# Altium project Sensors_CW.PrjPcb
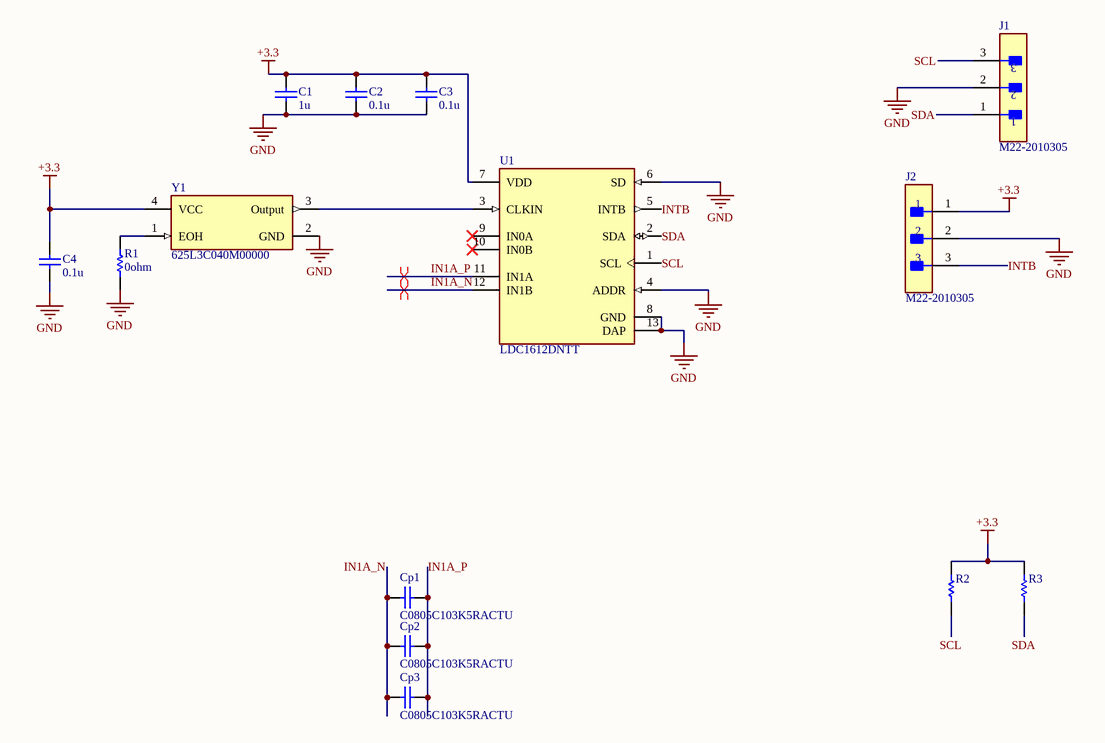
[diagram p0: Schematic_Sensors.SchDoc]
1 sheet, 14 parts. Net scope: global (net labels, ports and power ports of the same name join across sheets).
Board files: PCB_Sensors.PcbDoc, PCB1.PcbDoc

## Sheet Schematic_Sensors.SchDoc
size A3; SheetNumber: 1; SheetTotal: 1

### Parts
C1  1u  [CAPC1608X90X35ML10T15]
C2  0.1u  [CAPC1608X90X35ML10T15]
C3  0.1u  [CAPC1608X90X35ML10T15]
C4  0.1u  [CAPC1608X90X35ML10T15]
Cp1  C0805C103K5RACTU  [CAPC2013X88X50LL20T25]
Cp2  C0805C103K5RACTU  [CAPC2013X88X50LL20T25]
Cp3  C0805C103K5RACTU  [CAPC2013X88X50LL20T25]
J1  M22-2010305  [FP-M22-2010305-MFG]
J2  M22-2010305  [FP-M22-2010305-MFG]
R1  0ohm  [RESC1608X55X25ML10T15]
R2  CRCW060310K0FKEA  [RESC1609X50X30NL8T20]  (value not drawn)
R3  CRCW060310K0FKEA  [RESC1609X50X30NL8T20]  (value not drawn)
U1  LDC1612DNTT  [FP-DNT0012B-MFG]
Y1  625L3C040M00000  [FP-625-MFG]

### Nets
+3.3: C1.2 C2.2 C3.2 C4.2 J2.1 R2.2 R3.2 U1.7(VDD) Y1.4(VCC)
GND: C1.1 C2.1 C3.1 C4.1 J1.2 J2.2 R1.1 U1.4(ADDR) U1.6(SD) U1.8(GND) U1.13(DAP) Y1.2(GND)
IN1A_N: Cp1.1 Cp2.1 Cp3.1 U1.12(IN1B)
IN1A_P: Cp1.2 Cp2.2 Cp3.2 U1.11(IN1A)
INTB: J2.3 U1.5(INTB)
SCL: J1.3 R2.1 U1.1(SCL)
SDA: J1.1 R3.1 U1.2(SDA)
NetR1_2: R1.2 Y1.1(EOH)
NetU1_3: U1.3(CLKIN) Y1.3(Output)

Not connected (* = marked no-connect by the designer): U1 9(IN0A)* 10(IN0B)*

### Layout directives
differential pair: IN1A_N, IN1A_P

### Library data of the parts
C1-C4 = CMP-2000-04945-1: Chip Capacitor, 22 pF, +/- 5%, 50 V, -55 to 125 degC, 0603 (1608 Metric), RoHS, Tape and Reel; Manufacturer: Murata; Capacitance: 22pF; Rated Voltage: 50V; Dielectric: C0G; Manufacturer URL: http://www.murata.com/; Datasheet Version: Jul-06; Package Reference: 603; Tolerance (%): ±5%; Case Size/Dimension: 0603; Package Description: 2-Pin Surface Mount Device, Body 1.6 x 0.8 mm; Datasheet URL: https://datasheet.ciiva.com/11786/0900766b807a1cab-11786398.pdf
Cp1-Cp3 = CMP-2007-00266-1: Manufacturer: Kemet; Part Number: C0805C103K5RACTU
J1 J2 = CMP-15831-000100-1: CONN HEADER VERT 3POS 2MM; Voltage Rating (AC): 250V; Current Rating: 1A; Contact Resistance: 20mR; Number of Positions: 3; Mated Stacking Heights: 8.6mm; Voltage Rating: 650V; Insulation Resistance: 10GR; Connector Type: Male Pin; Contact Shape: Square; Min Operating Temperature: -55°C; Lead Pitch: 2mm; Contact Plating: Gold; Pitch: 2mm; Max Operating Temperature: 105°C; Color: Black; Series: M22; Orientation: Straight; Number of Contacts: 3; Max Current Rating: 1A; Contact Material: Bronze; Packaging: Bulk; Housing Color: Black; Housing Material: Nylon; Mount: Through Hole; Case/Package: SIL; Working Voltage: 250V; Reach SVHC Compliant: Yes; Number of Rows: 1; Package Quantity: 1000; Insulation Material: Nylon; Length: 6mm; Contact Finish - Mating: GOLD; Depth: 2mm; Contact Type: Male Pin; Insulation Color: Black; Termination: Solder; RoHS Compliant: Yes; Radiation Hardening: No; Flammability Rating: UL94 V-0; Contact Mating Length: 0.138inch; Fastening Type: Pull
R1 = CMP-2100-03667-1: Chip Resistor, 0 Ohm, +/- 5%, 0.1 W, -55 to 155 degC, 0603 (1608 Metric), RoHS, Tape and Reel; Manufacturer: Yageo; Temperature Coefficient: 200ppm/degreesC; Voltage Rating: 50V; Power Rating: 100mW; Resistance: 0mOhm; Width: 0.8mm; Max Operating Temperature: 155degC; Tolerance: 5%; Package Reference: 0603; Height: 0.45mm; Depth: 0.8mm; Package Description: 2-Pin Surface Mount Device, Body 1.6 x 0.8 mm; Termination: SMD/SMT; Package Quantity: 5000; Case/Package: 0603; Case Code (Imperial): 0603; Radiation Hardening: No; Number of Pins: 2; Length: 1.6mm; Lead Free: LeadFree; Voltage Rating (DC): 50V; Military Standard: Not; Datasheet URL: http://www.yageo.com/NewPortal/yageodocoutput?fileName=/pdf/R-Chip/PYu-RC_Group_51_RoHS_L_5.pdf; Manufacturer URL: http://www.yageo.com/; Packaging: TapeandReel; Case Code (Metric): 1608; Min Operating Temperature: -55degC; Composition: ThickFilm; RoHSCompliant: true; Contact Plating: Tin; Datasheet Version: Rev. 5, 10/2016; REACH SVHC: NoSVHC
R2 R3 = CMP-1666-00005-4: Chip Resistor, 10 KOhm, +/- 1%, 100 mW, -55 to 155 degC, 0603 (1608 Metric), RoHS, Tape and Reel; Manufacturer: Vishay Semiconductor; Voltage Rating: 75 V; Max Operating Temperature: 155 degC; PackageDescription: 2-Pin Surface Mount Device, Body 1.575 x 0.85 mm; ComponentLink1Description: Manufacturer URL; RoHSCompliant: true; PackageReference: 0603; REACH SVHC: Unknown; Length: 1.55 mm; DatasheetVersion: 06/2012; Packaging: Tape and Reel; Min Operating Temperature: -55 degC; Mounting Technology: Surface Mount; ComponentLink2URL: https://datasheet.ciiva.com/11809/0900766b80d98afc-11809037.pdf; Height: 0.45 mm; ComponentLink2Description: Datasheet; Package Quantity: 5000; ComponentLink1URL: http://www.vishay.com/
U1 = CMP-04859-000002-1: IC IND TO DGTL 28BIT 1K 12WSON; Sampling Rate: 1000S/s; Supply Type: Single; Interface: I2C; Resolution: 28b; Number of Inputs: 2; Max Operating Temperature: 125°C; Contact Plating: Tin; Mount: Surface Mount; Number of Pins: 12; Min Operating Temperature: -40°C; REACH SVHC: No SVHC; Lead Free: Lead Free; Packaging: Cut Tape; RoHS Compliant: Yes
Y1 = CMP-06858-000003-1: XTAL OSC XO 40.0000MHZ CMOS SMD; Max Supply Current: 15mA; Frequency: 40MHz; Frequency Stability: 50ppm; Min Supply Voltage: 2.97V; Max Supply Voltage: 3.63V; Load Capacitance: 15pF; Operating Supply Voltage: 3.3V; Min Operating Temperature: -10°C; Length: 2.5mm; Radiation Hardening: No; Max Operating Temperature: 70°C; Depth: 2mm; Mount: Surface Mount; Height: 0.039inch; Packaging: Tape and Reel; Case/Package: CSMD; Termination: SMD/SMT; Package Quantity: 3000; Contact Plating: Gold; Width: 0.079inch